# Altium schematic sheet OVERVIEW.SchDoc
size A4; SheetNumber: 1; SheetTotal: 7
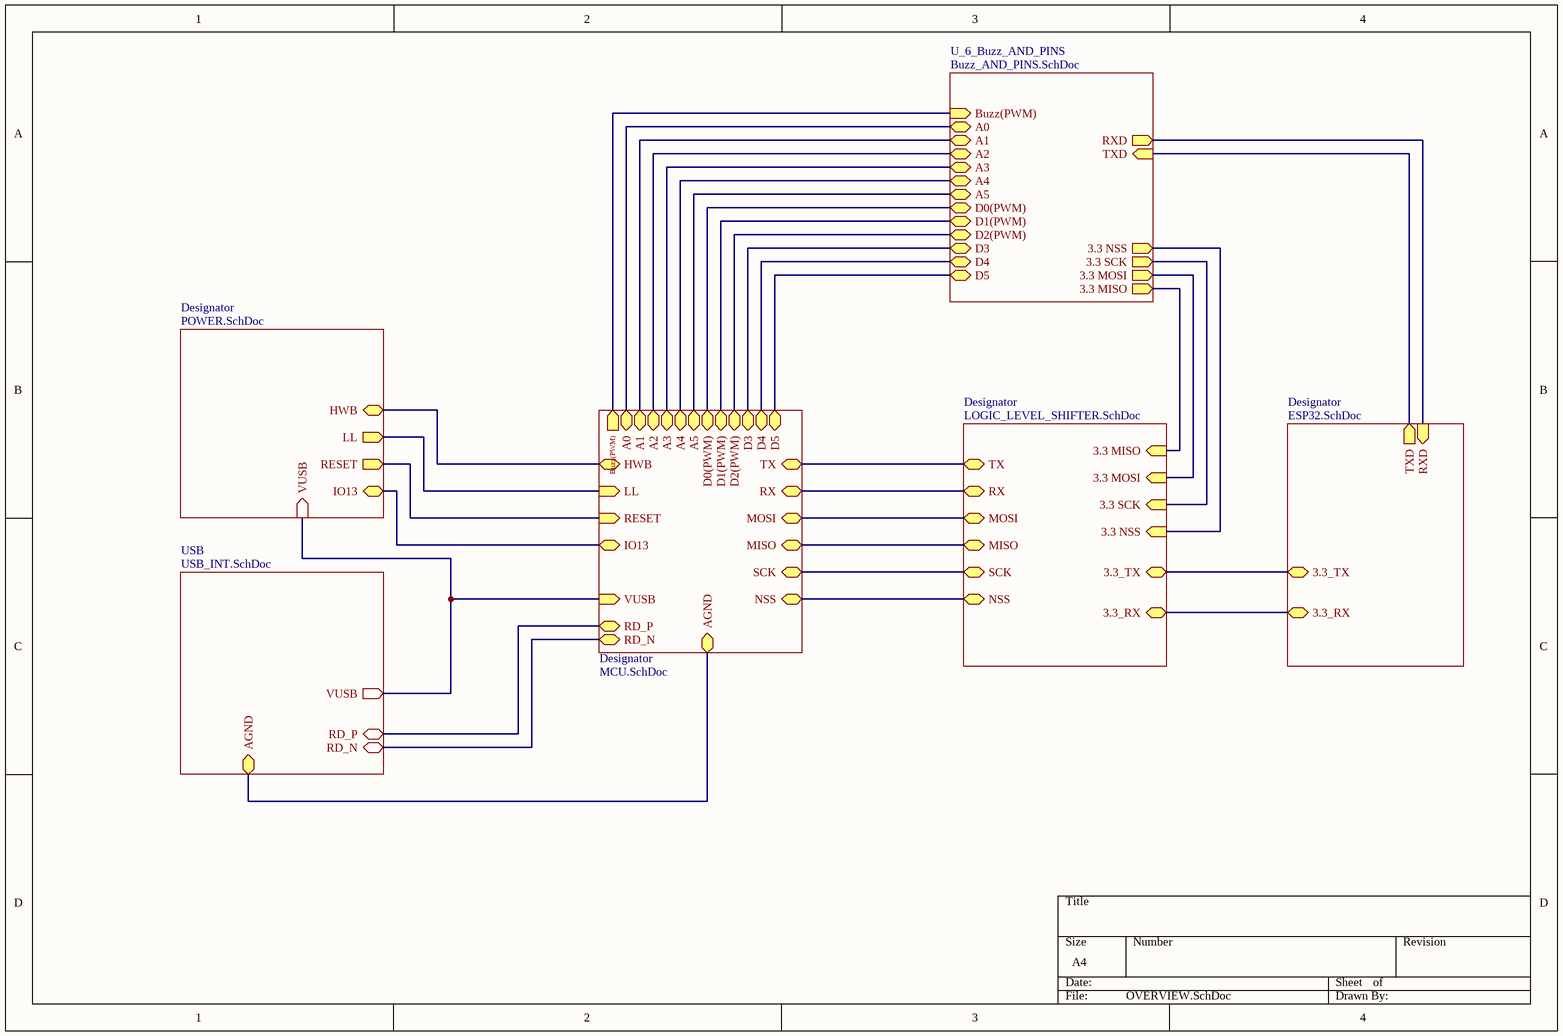
[diagram p0: OVERVIEW.SchDoc]

## Sub-sheets
Designator = MCU.SchDoc: RD_P (bidir), RD_N (bidir), VUSB (in), IO13 (bidir), RESET (in), LL (in), HWB (bidir), TX (bidir), RX (bidir), MOSI (bidir), MISO (bidir), SCK (bidir), NSS (bidir), Buzz(PWM) (out), A0 (bidir), A1 (bidir), A2 (bidir), A4 (bidir), A3 (bidir), D0(PWM) (bidir), A5 (bidir), D1(PWM) (bidir), D2(PWM) (bidir), D3 (bidir), D4 (bidir), D5 (bidir), AGND (bidir)
Designator = POWER.SchDoc: VUSB (in), HWB (bidir), LL (out), RESET (out), IO13 (bidir)
Designator = LOGIC_LEVEL_SHIFTER.SchDoc: TX (bidir), RX (bidir), MOSI (bidir), MISO (bidir), SCK (bidir), NSS (bidir), 3.3_TX (bidir), 3.3_RX (bidir), 3.3 MISO (in), 3.3 MOSI (in), 3.3 SCK (in), 3.3 NSS (in)
Designator = ESP32.SchDoc: 3.3_TX (bidir), 3.3_RX (bidir), RXD (in), TXD (out)
U_6_Buzz_AND_PINS = Buzz_AND_PINS.SchDoc: 3.3 NSS (out), 3.3 SCK (out), 3.3 MOSI (out), 3.3 MISO (out), Buzz(PWM) (in), A0 (bidir), A1 (bidir), A2 (bidir), A3 (bidir), A4 (bidir), A5 (bidir), D0(PWM) (bidir), D1(PWM) (bidir), D2(PWM) (bidir), D3 (bidir), D4 (bidir), D5 (bidir), TXD (in), RXD (out)
USB = USB_INT.SchDoc: VUSB (out), RD_P (bidir), RD_N (bidir), AGND (bidir)

## Nets
(unnamed): sheet Designator/RD_P, sheet USB/RD_P
(unnamed): sheet Designator/RD_N, sheet USB/RD_N
(unnamed): sheet Designator/VUSB, sheet Designator/VUSB, sheet USB/VUSB
(unnamed): sheet Designator/IO13, sheet Designator/IO13
(unnamed): sheet Designator/RESET, sheet Designator/RESET
(unnamed): sheet Designator/LL, sheet Designator/LL
(unnamed): sheet Designator/HWB, sheet Designator/HWB
(unnamed): sheet Designator/TX, sheet Designator/TX
(unnamed): sheet Designator/RX, sheet Designator/RX
(unnamed): sheet Designator/MOSI, sheet Designator/MOSI
(unnamed): sheet Designator/MISO, sheet Designator/MISO
(unnamed): sheet Designator/SCK, sheet Designator/SCK
(unnamed): sheet Designator/NSS, sheet Designator/NSS
(unnamed): sheet Designator/Buzz(PWM), sheet U_6_Buzz_AND_PINS/Buzz(PWM)
(unnamed): sheet Designator/A0, sheet U_6_Buzz_AND_PINS/A0
(unnamed): sheet Designator/A1, sheet U_6_Buzz_AND_PINS/A1
(unnamed): sheet Designator/A2, sheet U_6_Buzz_AND_PINS/A2
(unnamed): sheet Designator/A4, sheet U_6_Buzz_AND_PINS/A4
(unnamed): sheet Designator/A3, sheet U_6_Buzz_AND_PINS/A3
(unnamed): sheet Designator/D0(PWM), sheet U_6_Buzz_AND_PINS/D0(PWM)
(unnamed): sheet Designator/A5, sheet U_6_Buzz_AND_PINS/A5
(unnamed): sheet Designator/D1(PWM), sheet U_6_Buzz_AND_PINS/D1(PWM)
(unnamed): sheet Designator/D2(PWM), sheet U_6_Buzz_AND_PINS/D2(PWM)
(unnamed): sheet Designator/D3, sheet U_6_Buzz_AND_PINS/D3
(unnamed): sheet Designator/D4, sheet U_6_Buzz_AND_PINS/D4
(unnamed): sheet Designator/D5, sheet U_6_Buzz_AND_PINS/D5
(unnamed): sheet Designator/AGND, sheet USB/AGND
(unnamed): sheet Designator/3.3_TX, sheet Designator/3.3_TX
(unnamed): sheet Designator/3.3_RX, sheet Designator/3.3_RX
(unnamed): sheet Designator/3.3 MISO, sheet U_6_Buzz_AND_PINS/3.3 MISO
(unnamed): sheet Designator/3.3 MOSI, sheet U_6_Buzz_AND_PINS/3.3 MOSI
(unnamed): sheet Designator/3.3 SCK, sheet U_6_Buzz_AND_PINS/3.3 SCK
(unnamed): sheet Designator/3.3 NSS, sheet U_6_Buzz_AND_PINS/3.3 NSS
(unnamed): sheet Designator/RXD, sheet U_6_Buzz_AND_PINS/RXD
(unnamed): sheet Designator/TXD, sheet U_6_Buzz_AND_PINS/TXD